# Altium schematic sheet 功放原理图.SchDoc
size A4
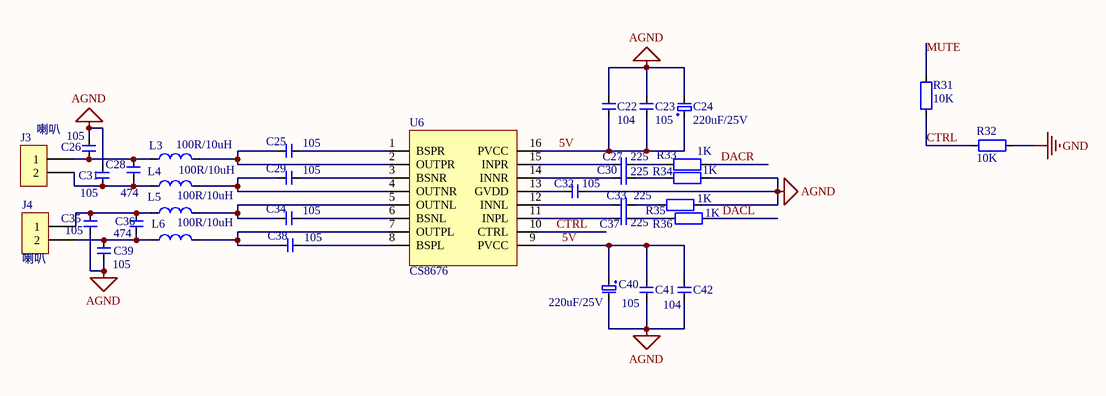
[diagram p0: 功放原理图.SchDoc]

## Parts
C22  104  [C0603]
C23  105  [C0603]
C24  220uF/25V  [EC2.5-6.3]
C25  105  [C0603]
C26  105  [C0603]
C27  225  [C0603]
C28  474  [C0603]
C29  105  [C0603]
C30  225  [C0603]
C31  105  [C0603]
C32  105  [C0603]
C33  225  [C0603]
C34  105  [C0603]
C35  105  [C0603]
C36  474  [C0603]
C37  225  [C0603]
C38  105  [C0603]
C39  105  [C0603]
C40  220uF/25V  [EC2.5-6.3]
C41  105  [C0603]
C42  104  [C0603]
J3  喇叭  [CON-2X2.54]
J4  喇叭  [CON-2X2.54]
L3  100R/10uH  [R1206]
L4  100R/10uH  [R1206]
L5  100R/10uH  [R1206]
L6  100R/10uH  [R1206]
R31  10K  [R0603]
R32  10K  [R0603]
R33  1K  [R0603]
R34  1K  [R0603]
R35  1K  [R0603]
R36  1K  [R0603]
U6  CS8676  [SOP16-EP]

## Nets
AGND: C22.2 C23.2 C24.2 C26.2 C31.2 C32.2 C35.2 C39.2 C40.2 C41.2 C42.2 R34.2 R35.2
GND: R32.2
5V: C22.1 C23.1 C24.1 C40.1 C41.1 C42.1 U6.9(PVCC) U6.16(PVCC)
CTRL: R31.1 R32.1 U6.10(CTRL)
DACL: R36.2
DACR: R33.2
MUTE: R31.2
NetC25_1: C25.1 L3.2 U6.2(OUTPR)
NetC25_2: C25.2 U6.1(BSPR)
NetC26_1: C26.1 C28.2 J3.1 L3.1
NetC27_1: C27.1 U6.15(INPR)
NetC27_2: C27.2 R33.1
NetC28_1: C28.1 C31.1 J3.2 L4.1
NetC29_1: C29.1 L4.2 U6.4(OUTNR)
NetC29_2: C29.2 U6.3(BSNR)
NetC30_1: C30.1 U6.14(INNR)
NetC30_2: C30.2 R34.1
NetC32_1: C32.1 U6.13(GVDD)
NetC33_1: C33.1 U6.12(INNL)
NetC33_2: C33.2 R35.1
NetC34_1: C34.1 L5.2 U6.5(OUTNL)
NetC34_2: C34.2 U6.6(BSNL)
NetC35_1: C35.1 C36.2 J4.1 L5.1
NetC36_1: C36.1 C39.1 J4.2 L6.1
NetC37_1: C37.1 U6.11(INPL)
NetC37_2: C37.2 R36.1
NetC38_1: C38.1 L6.2 U6.7(OUTPL)
NetC38_2: C38.2 U6.8(BSPL)

## Notes on the sheet
- Title
- Size:
- Date:
- A4
- Number:
- Time:
- Revision:
- Sheet
- of
- File:

## Library data of the parts
C22 C23 C25-C39 C41 C42 = CAP-0603
C24 C40 = +CAP
J3 J4 = CON2: Connector
L3-L6 = L
R31-R36 = RES-0603